# EAGLE design Teensy Board (EAGLE 7.6.0)
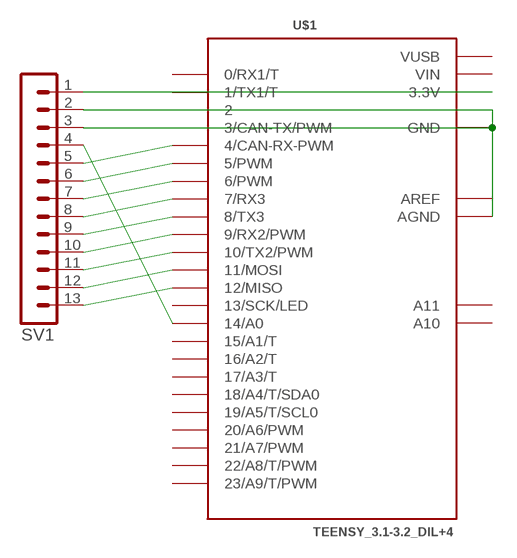
[diagram p0: schematic, sheet 1]

## Parts
SV1  MA13-1  [MA13-1]
U$1  TEENSY_3.1-3.2_DIL+4  [TEENSY_3.0-3.2&LC_DIL+4]

## Nets
N$1: SV1.2 SV1.3 U$1.AGND U$1.GND
N$2: SV1.1 U$1.3.3V
N$3: SV1.13 U$1.12(12/MISO)
N$4: SV1.12 U$1.11(11/MOSI)
N$5: SV1.11 U$1.10(10/TX2/PWM)
N$6: SV1.10 U$1.9(9/RX2/PWM)
N$7: SV1.9 U$1.8(8/TX3)
N$8: SV1.8 U$1.7(7/RX3)
N$9: SV1.7 U$1.6(6/PWM)
N$10: SV1.6 U$1.5(5/PWM)
N$11: SV1.5 U$1.4(4/CAN-RX-PWM)
N$12: SV1.4 U$1.14/A0
Unconnected: U$1.0(0/RX1/T) U$1.1(1/TX1/T) U$1.2 U$1.3(3/CAN-TX/PWM) U$1.13(13/SCK/LED) U$1.15/A1(15/A1/T) U$1.16/A2(16/A2/T) U$1.17/A3(17/A3/T) U$1.18/A4(18/A4/T/SDA0) U$1.19/A5(19/A5/T/SCL0) U$1.20/A6(20/A6/PWM) U$1.21/A7(21/A7/PWM) U$1.22/A8(22/A8/T/PWM) U$1.23/A9(23/A9/T/PWM) U$1.A10 U$1.A11

## Power pins joined to a net without a drawn wire
AREF: U$1.AREF
VIN: U$1.VIN
VUSB: U$1.VUSB

## Library data of the parts
SV1 = con-lstb:MA13-1: PIN HEADER; OC_FARNELL: unknown; OC_NEWARK: unknown
U$1 = Teensy_3_and_LC_Series_Boards_v1.4:TEENSY_3.1-3.2_DIL+4: Teensy 3.1 and 3.2 in a DIL package with the inner 4 pins

## Board
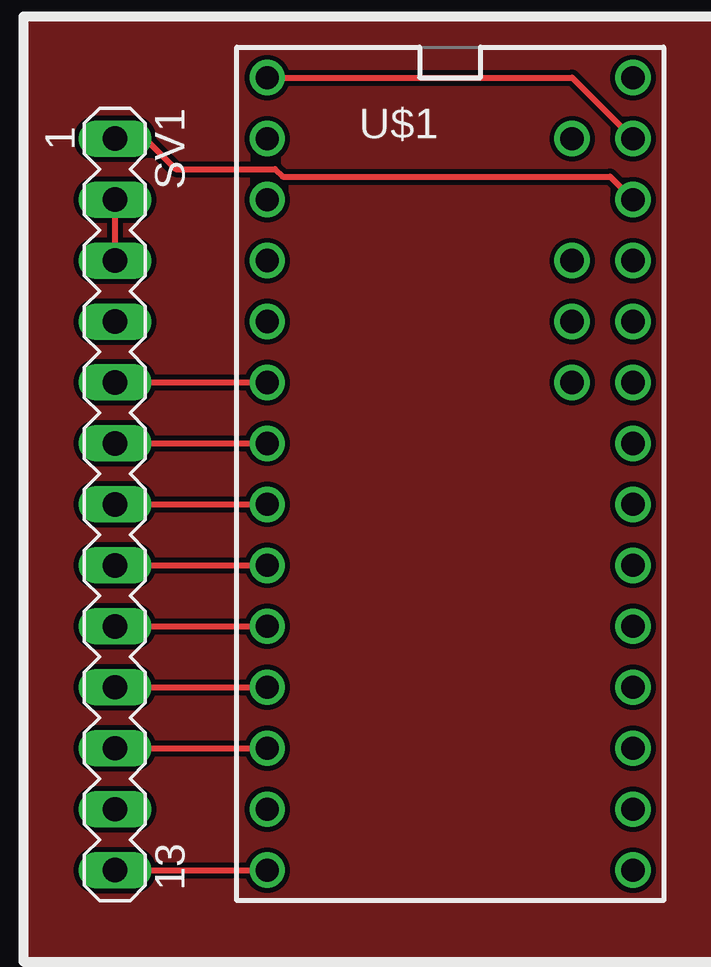
[diagram p1: board, top side]
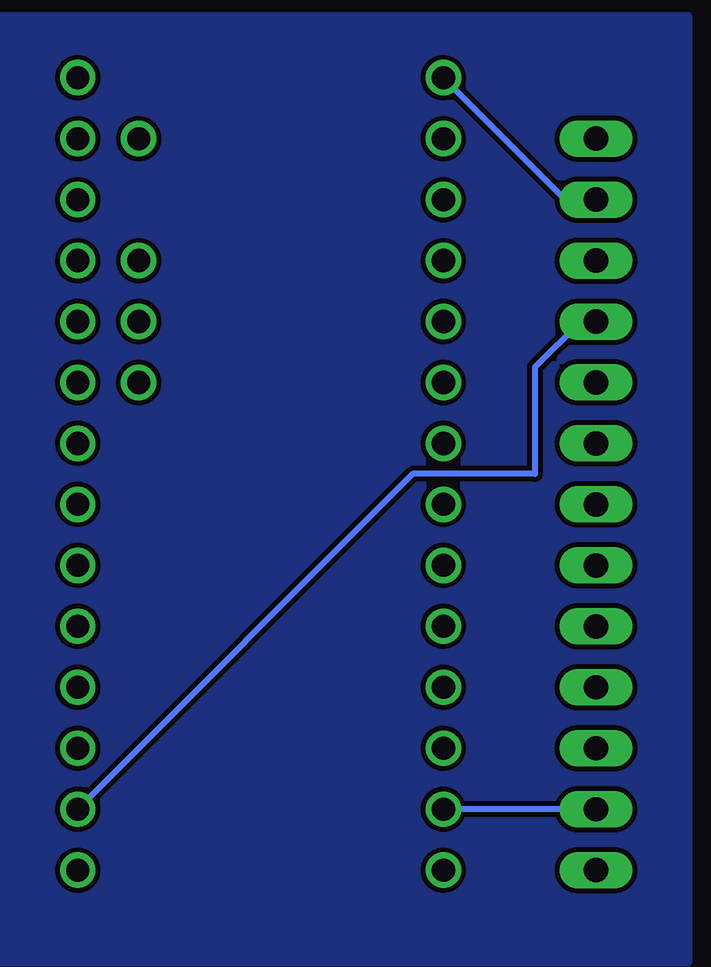
[diagram p2: board, bottom side, seen from below]

No outline drawn. Coordinates in mm, seen from the top.
Copper layers (1*16): Top 0.035mm / dielectric 1.5mm / Bottom 0.035mm
Design rules "default": minimum track width 10mil, minimum drill 24mil, track to track 8mil, track to pad 8mil, pad to pad 8mil, via to via 8mil, smd to smd 8mil, copper to edge 40mil, drill to drill 8mil, minimum pad ring 10mil, minimum via ring 8mil, stop-mask expansion 4mil, vias tented up to drill 0mil, thermal gap 10mil

### Footprints (pad centres in the part's own frame; a part is rotated, then mirrored left to right if it is on the bottom)
MA13-1 = drill 1.016 long: 1 -15.24,0; 2 -12.7,0; 3 -10.16,0; 4 -7.62,0; 5 -5.08,0; 6 -2.54,0; 7 0,0; 8 2.54,0; 9 5.08,0; 10 7.62,0; 11 10.16,0; 12 12.7,0; 13 15.24,0
TEENSY_3.0-3.2&LC_DIL+4 = drill 0.965: 0 -7.62,13.97; 1 -7.62,11.43; 2 -7.62,8.89; 3 -7.62,6.35; 3.3V 7.62,11.43; 4 -7.62,3.81; 5 -7.62,1.27; 6 -7.62,-1.27; 7 -7.62,-3.81; 8 -7.62,-6.35; 9 -7.62,-8.89; 10 -7.62,-11.43; 11 -7.62,-13.97; 12 -7.62,-16.51; 13 7.62,-16.51; 14/A0 7.62,-13.97; 15/A1 7.62,-11.43; 16/A2 7.62,-8.89; 17/A3 7.62,-6.35; 18/A4 7.62,-3.81; 19/A5 7.62,-1.27; 20/A6 7.62,1.27; 21/A7 7.62,3.81; 22/A8 7.62,6.35; 23/A9 7.62,8.89; A10 5.08,6.35; A11 5.08,3.81; AGND 7.62,13.97; AREF 5.08,8.89; GND -7.62,16.51; VIN 7.62,16.51; VUSB 5.08,13.97

### Placement (x,y rotation side)
SV1  10.16,52.07 270 top
U$1  24.13,53.34 0 top

### Tracks (layer width: path | path; a pad name or v marks a point on that pad's centre or on a via)
N$1
  Top 0.254: U$1.AGND 29.21,69.85 U$1.GND | SV1.2 SV1.3
  Bottom 0.254: U$1.GND 11.43,64.77 SV1.2
N$2
  Top 0.254: U$1.3.3V 30.8,65.72 17.14,65.72 16.83,66.04 12.7,66.04 11.43,67.31 SV1.1
N$3
  Top 0.254: SV1.13 U$1.12
N$4
  Bottom 0.254: SV1.12 U$1.11
N$5
  Top 0.254: SV1.11 U$1.10
N$6
  Top 0.254: SV1.10 U$1.9
N$7
  Top 0.254: SV1.9 U$1.8
N$8
  Top 0.254: SV1.8 U$1.7
N$9
  Top 0.254: SV1.7 U$1.6
N$10
  Top 0.254: SV1.6 U$1.5
N$11
  Top 0.254: SV1.5 U$1.4
N$12
  Bottom 0.254: U$1.14/A0 17.78,53.34 12.7,53.34 12.7,57.78 10.79,59.69 SV1.4
N$13
  pour Top: 6.35,72.39 6.35,33.02 38.1,33.02 38.1,72.39
N$14
  pour Bottom: 6.35,72.39 6.35,33.02 38.1,33.02 38.1,72.39